# EAGLE schematic Si1145_schematic (EAGLE 6.6.0)
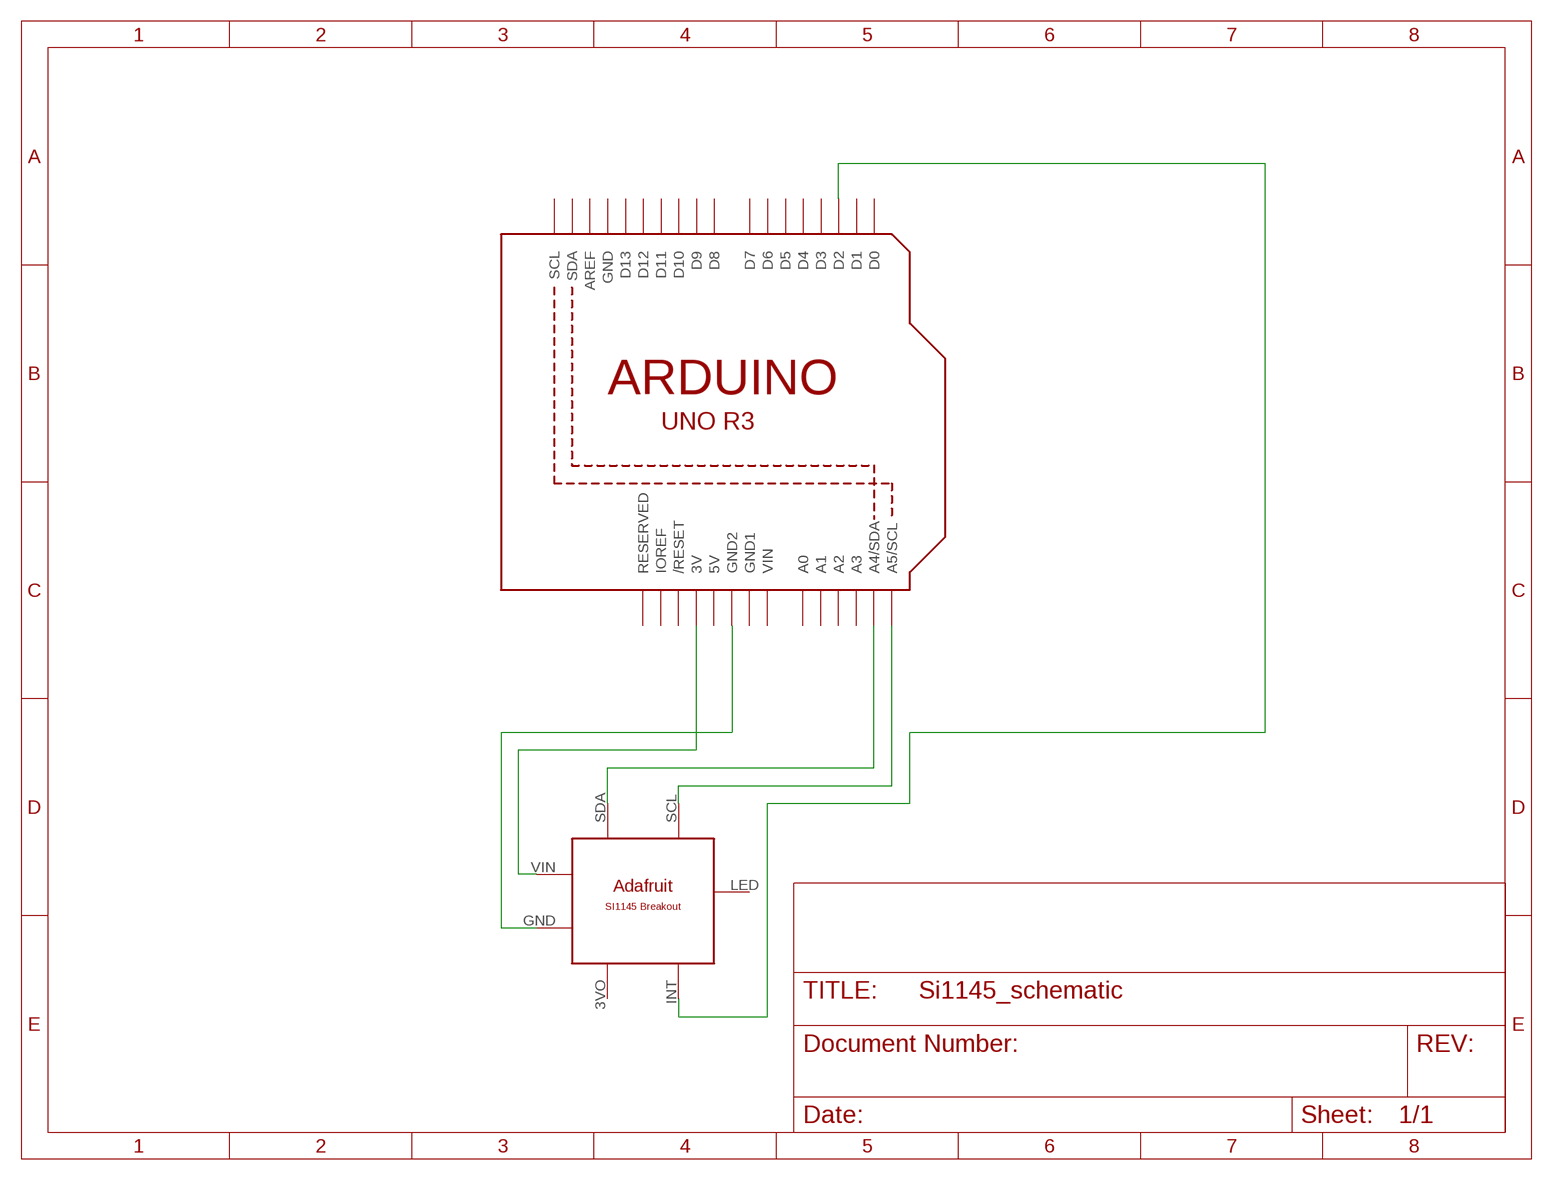
[diagram p0: schematic, sheet 1]

## Parts
U1  ARDUINOR3-DIMENSION  [ARDUINOR3]
U$4  ADAFRUIT_SI1145_BREAKOUT  [ADAFRUIT_SI1145_BREAKOUT_HEADERS]

## Nets
3V: U1.3V U$4.VIN
N$2: U1.A4(A4/SDA) U$4.SDA
N$3: U1.D2 U$4.INT
N$12: U1.A5(A5/SCL) U$4.SCL
N$16: U1.GND2 U$4.GND
Unconnected: U1.A0 U1.A1 U1.A2 U1.A3 U1.AREF U1.D0 U1.D1 U1.D3 U1.D4 U1.D5 U1.D6 U1.D7 U1.D8 U1.D9 U1.D10 U1.D11 U1.D12 U1.D13 U1.IOREF U1.RESERVED U1.RESET(/RESET) U1.SCL U1.SDA U$4.LED

## Power pins joined to a net without a drawn wire
3VO: U$4.3VO
5V: U1.5V
GND: U1.GND
GND1: U1.GND1
VIN: U1.VIN

## Library data of the parts
U1 = adafruit:ARDUINOR3: This is a new object for the new Arduino R3 - with extra pins that you may want to use (such as IOref, and duplicated A4/A5
U$4 = BLE_sensor_parts:ADAFRUIT_SI1145_BREAKOUT